# EAGLE schematic LTC_Balancer (EAGLE 5.06)
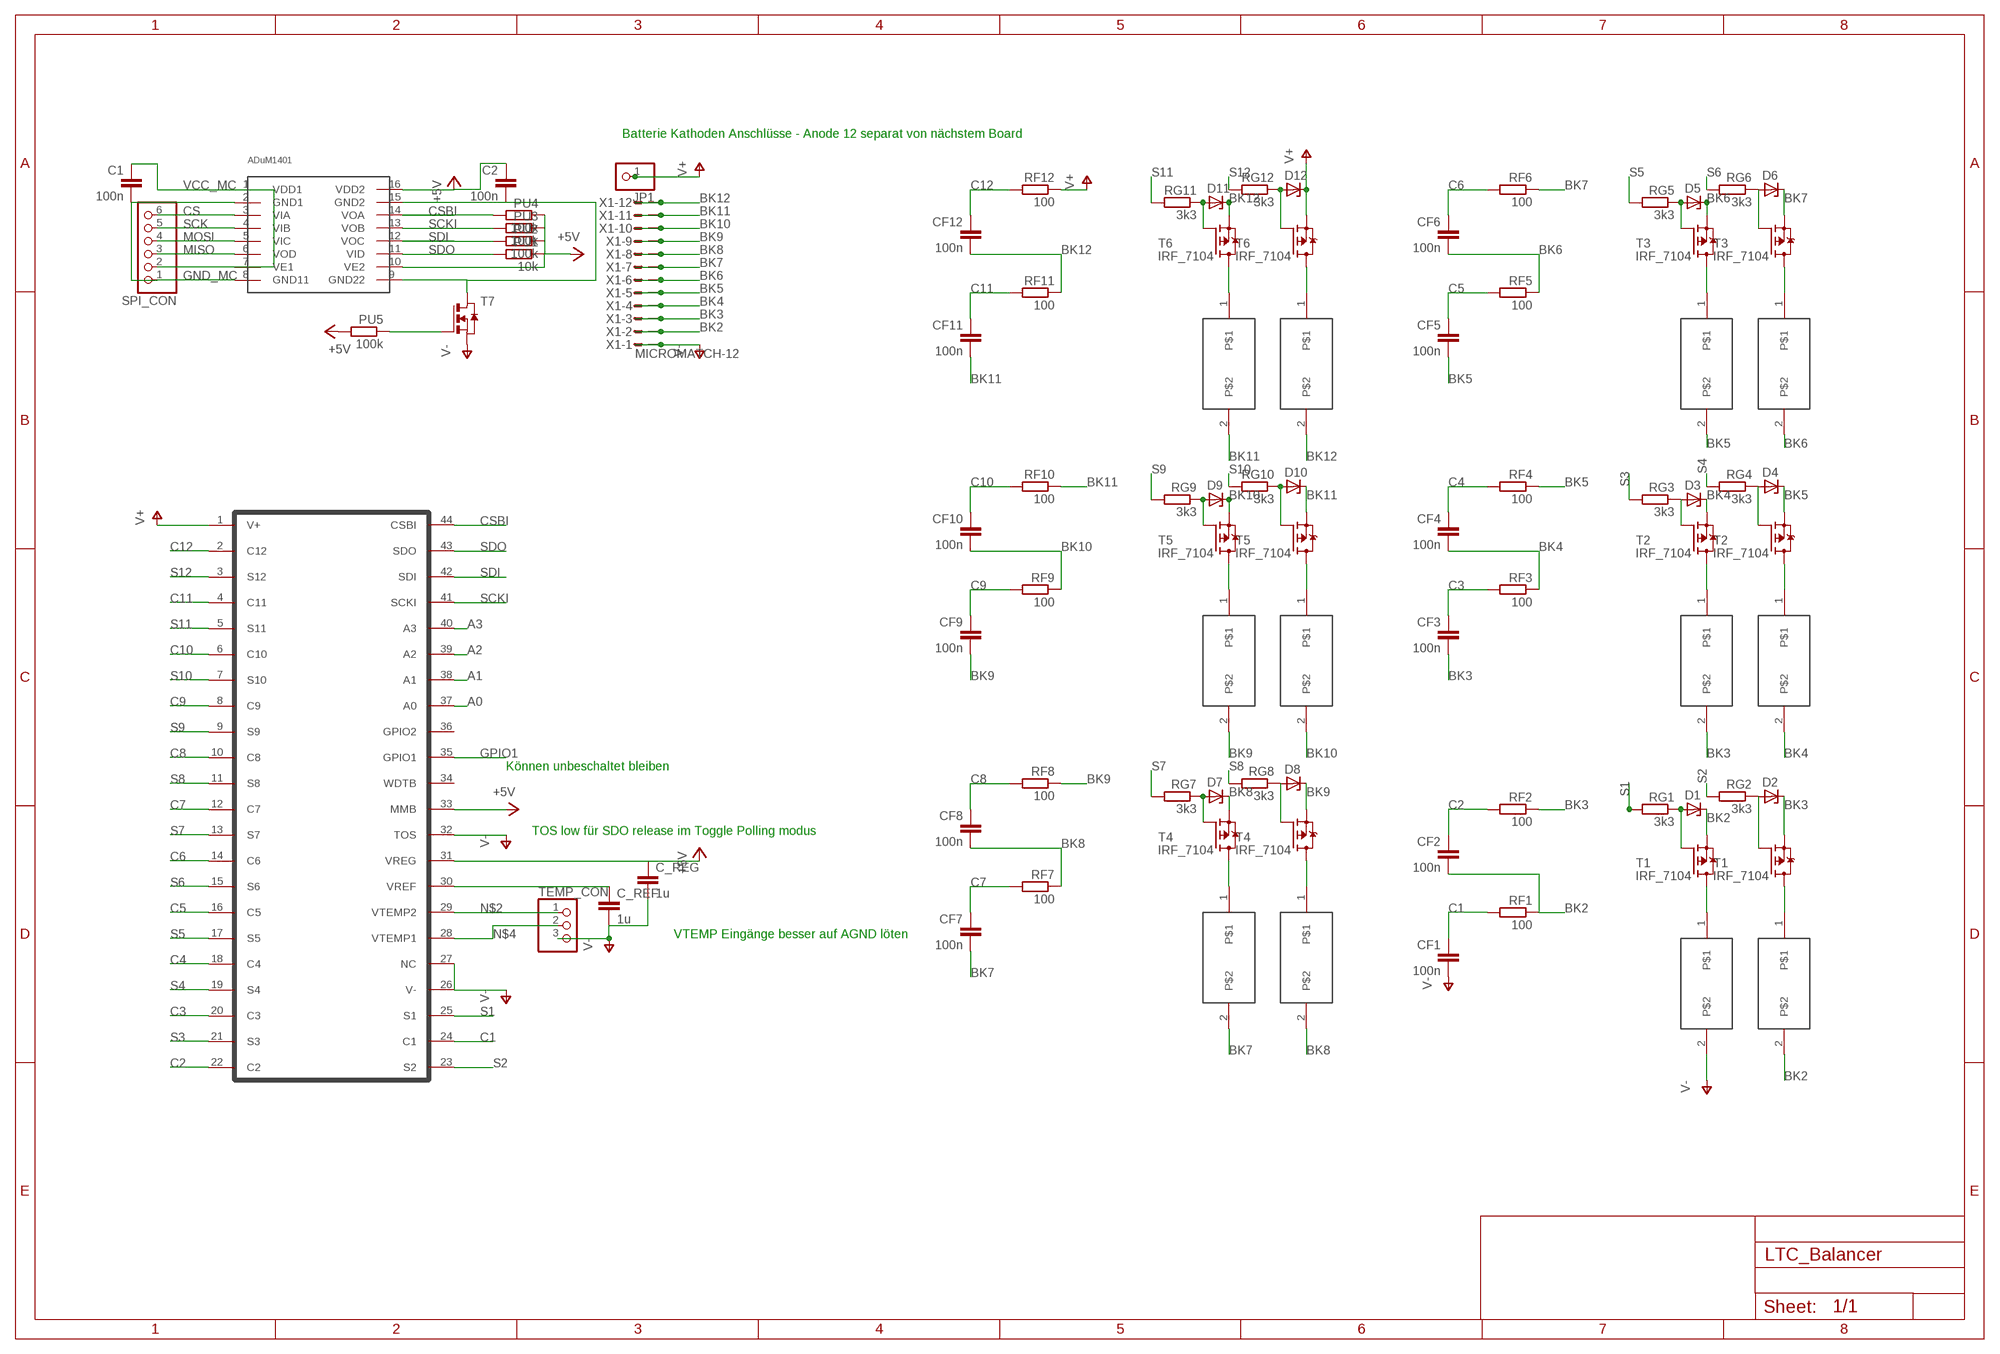
[diagram p0: schematic, sheet 1]

## Parts
C1  100n  C-EUC0805  [C0805]
C2  100n  C-EUC0805  [C0805]
C_REF  1u  C-EUC0805  [C0805]
C_REG  1u  C-EUC0805  [C0805]
CF1  100n  C-EUC1206  [C1206]
CF2  100n  C-EUC1206  [C1206]
CF3  100n  C-EUC1206  [C1206]
CF4  100n  C-EUC1206  [C1206]
CF5  100n  C-EUC1206  [C1206]
CF6  100n  C-EUC1206  [C1206]
CF7  100n  C-EUC1206  [C1206]
CF8  100n  C-EUC1206  [C1206]
CF9  100n  C-EUC1206  [C1206]
CF10  100n  C-EUC1206  [C1206]
CF11  100n  C-EUC1206  [C1206]
CF12  100n  C-EUC1206  [C1206]
D1  ZENER-DIODESOD80C  [SOD80C]
D2  ZENER-DIODESOD80C  [SOD80C]
D3  ZENER-DIODESOD80C  [SOD80C]
D4  ZENER-DIODESOD80C  [SOD80C]
D5  ZENER-DIODESOD80C  [SOD80C]
D6  ZENER-DIODESOD80C  [SOD80C]
D7  ZENER-DIODESOD80C  [SOD80C]
D8  ZENER-DIODESOD80C  [SOD80C]
D9  ZENER-DIODESOD80C  [SOD80C]
D10  ZENER-DIODESOD80C  [SOD80C]
D11  ZENER-DIODESOD80C  [SOD80C]
D12  ZENER-DIODESOD80C  [SOD80C]
JP1  PINHD-1X1  [1X01]
PU1  10k  R-EU_R0805  [R0805]
PU2  100k  R-EU_R0805  [R0805]
PU3  100k  R-EU_R0805  [R0805]
PU4  100k  R-EU_R0805  [R0805]
PU5  100k  R-EU_R0805  [R0805]
RF1  100  R-EU_R1206  [R1206]
RF2  100  R-EU_R1206  [R1206]
RF3  100  R-EU_R1206  [R1206]
RF4  100  R-EU_R1206  [R1206]
RF5  100  R-EU_R1206  [R1206]
RF6  100  R-EU_R1206  [R1206]
RF7  100  R-EU_R1206  [R1206]
RF8  100  R-EU_R1206  [R1206]
RF9  100  R-EU_R1206  [R1206]
RF10  100  R-EU_R1206  [R1206]
RF11  100  R-EU_R1206  [R1206]
RF12  100  R-EU_R1206  [R1206]
RG1  3k3  R-EU_R0805  [R0805]
RG2  3k3  R-EU_R0805  [R0805]
RG3  3k3  R-EU_R0805  [R0805]
RG4  3k3  R-EU_R0805  [R0805]
RG5  3k3  R-EU_R0805  [R0805]
RG6  3k3  R-EU_R0805  [R0805]
RG7  3k3  R-EU_R0805  [R0805]
RG8  3k3  R-EU_R0805  [R0805]
RG9  3k3  R-EU_R0805  [R0805]
RG10  3k3  R-EU_R0805  [R0805]
RG11  3k3  R-EU_R0805  [R0805]
RG12  3k3  R-EU_R0805  [R0805]
RL1  R_5W  [R_5W]
RL2  R_5W  [R_5W]
RL3  R_5W  [R_5W]
RL4  R_5W  [R_5W]
RL5  R_5W  [R_5W]
RL6  R_5W  [R_5W]
RL7  R_5W  [R_5W]
RL8  R_5W  [R_5W]
RL9  R_5W  [R_5W]
RL10  R_5W  [R_5W]
RL11  R_5W  [R_5W]
RL12  R_5W  [R_5W]
SPI_CON  PINHD-1X6  [1X06]
T1  IRF_7104  [SO8]
T2  IRF_7104  [SO8]
T3  IRF_7104  [SO8]
T4  IRF_7104  [SO8]
T5  IRF_7104  [SO8]
T6  IRF_7104  [SO8]
T7  NMOSSOT23  [SOT-23]
TEMP_CON  PINHD-1X3  [1X03]
U$1  LTC6802-2  [SSOP44DL]
U$3  ADUM1401  [SO16]
X1  MICROMATCH-12  [MICROMATCH-12]

## Nets
+5V: C2.1 C_REG.1 PU1.1 PU2.1 PU3.1 PU4.1 PU5.2 U$1.31(VREG) U$1.33(MMB) U$3.10(VE2) U$3.16(VDD2)
A0: U$1.37(A0)
A1: U$1.38(A1)
A2: U$1.39(A2)
A3: U$1.40(A3)
ASD: RL5.1 T3.7(D2)
BK2: CF2.2 D1.C RF1.1 RL2.2 T1.1(S2) X1.2
BK3: CF3.2 D2.C RF2.1 RL3.2 T1.3(S1) X1.3
BK4: CF4.2 D3.C RF3.1 RL4.2 T2.1(S2) X1.4
BK5: CF5.2 D4.C RF4.1 RL5.2 T2.3(S1) X1.5
BK6: CF6.2 D5.C RF5.1 RL6.2 T3.1(S2) X1.6
BK7: CF7.2 D6.C RF6.1 RL7.2 T3.3(S1) X1.7
BK8: CF8.2 D7.C RF7.1 RL8.2 T4.1(S2) X1.8
BK9: CF9.2 D8.C RF8.1 RL9.2 T4.3(S1) X1.9
BK10: CF10.2 D9.C RF9.1 RL10.2 T5.1(S2) X1.10
BK11: CF11.2 D10.C RF10.1 RL11.2 T5.3(S1) X1.11
BK12: CF12.2 D11.C RF11.1 RL12.2 T6.1(S2) X1.12
C1: CF1.1 RF1.2 U$1.24(C1)
C2: CF2.1 RF2.2 U$1.22(C2)
C3: CF3.1 RF3.2 U$1.20(C3)
C4: CF4.1 RF4.2 U$1.18(C4)
C5: CF5.1 RF5.2 U$1.16(C5)
C6: CF6.1 RF6.2 U$1.14(C6)
C7: CF7.1 RF7.2 U$1.12(C7)
C8: CF8.1 RF8.2 U$1.10(C8)
C9: CF9.1 RF9.2 U$1.8(C9)
C10: CF10.1 RF10.2 U$1.6(C10)
C11: CF11.1 RF11.2 U$1.4(C11)
C12: CF12.1 RF12.2 U$1.2(C12)
CS: SPI_CON.6 U$3.3(VIA)
CSBI: PU4.2 U$1.44(CSBI) U$3.14(VOA)
GND_MC: C1.2 SPI_CON.1 U$3.2(GND1) U$3.8(GND11)
GPIO1: PU5.1 T7.3(G) U$1.35(GPIO1)
MISO: SPI_CON.3 U$3.6(VOD)
MOSI: SPI_CON.4 U$3.5(VIC)
N$2: TEMP_CON.1 U$1.29(VTEMP2)
N$3: C_REF.1 U$1.30(VREF)
N$4: TEMP_CON.2 U$1.28(VTEMP1)
N$5: RL3.1 T2.7(D2)
N$6: RL4.1 T2.5(D1)
N$7: C2.2 T7.1(D) U$3.9(GND22) U$3.15(GND2)
N$8: RL1.1 T1.7(D2)
N$9: RL2.1 T1.5(D1)
N$10: RL6.1 T3.5(D1)
N$11: RL7.1 T4.7(D2)
N$12: RL8.1 T4.5(D1)
N$13: RL9.1 T5.7(D2)
N$14: RL10.1 T5.5(D1)
N$15: RL11.1 T6.7(D2)
N$16: RL12.1 T6.5(D1)
N$17: D1.A RG1.1 T1.2(G2)
N$23: D2.A RG2.1 T1.4(G1)
N$55: D3.A RG3.1 T2.2(G2)
N$56: D4.A RG4.1 T2.4(G1)
N$57: D5.A RG5.1 T3.2(G2)
N$58: D7.A RG7.1 T4.2(G2)
N$59: D6.A RG6.1 T3.4(G1)
N$60: D8.A RG8.1 T4.4(G1)
N$61: D9.A RG9.1 T5.2(G2)
N$62: D10.A RG10.1 T5.4(G1)
N$63: D11.A RG11.1 T6.2(G2)
N$64: D12.A RG12.1 T6.4(G1)
S1: RG1.2 U$1.25(S1)
S2: RG2.2 U$1.23(S2)
S3: RG3.2 U$1.21(S3)
S4: RG4.2 U$1.19(S4)
S5: RG5.2 U$1.17(S5)
S6: RG6.2 U$1.15(S6)
S7: RG7.2 U$1.13(S7)
S8: RG8.2 U$1.11(S8)
S9: RG9.2 U$1.9(S9)
S10: RG10.2 U$1.7(S10)
S11: RG11.2 U$1.5(S11)
S12: RG12.2 U$1.3(S12)
SCK: SPI_CON.5 U$3.4(VIB)
SCKI: PU3.2 U$1.41(SCKI) U$3.13(VOB)
SDI: PU2.2 U$1.42(SDI) U$3.12(VOC)
SDO: PU1.2 U$1.43(SDO) U$3.11(VID)
V+: D12.C JP1.1 RF12.1 T6.3(S1) U$1.1(V+)
V-: C_REF.2 C_REG.2 CF1.2 RL1.2 T7.2(S) TEMP_CON.3 U$1.26(V-) U$1.27(NC) U$1.32(TOS) X1.1
VCC_MC: C1.1 SPI_CON.2 U$3.1(VDD1) U$3.7(VE1)
Unconnected: U$1.34(WDTB) U$1.36(GPIO2)

## Notes on the sheet
- Batterie Kathoden Anschlüsse - Anode 12 separat von nächstem Board
- Können unbeschaltet bleiben
- TOS low für SDO release im Toggle Polling modus
- VTEMP Eingänge besser auf AGND löten

## Library data of the parts
C1 C2 C_REF C_REG CF1-CF12 = rcl:C-EU: CAPACITOR, European symbol
D1-D12 = diode:ZENER-DIODE: Z-Diode
JP1 = pinhead:PINHD-1X1: PIN HEADER
PU1-PU5 RF1-RF12 RG1-RG12 = rcl:R-EU_: RESISTOR, European symbol
RL1-RL12 = R_Power:R_5W
SPI_CON = pinhead:PINHD-1X6: PIN HEADER
T1-T6 = IRF_7104:IRF_7104
T7 = zetex:NMOSSOT23: MOS FET
TEMP_CON = pinhead:PINHD-1X3: PIN HEADER
U$1 = LTC6802:LTC6802-2
U$3 = ADuM1401:ADUM1401
X1 = con-amp-micromatch:MICROMATCH-12: MicroMaTch 12 8-215464-2 / 1-215464-2 Drawing Number C-215464 DDEController.pdf